# EAGLE design H00R30 (EAGLE 9.3.0)
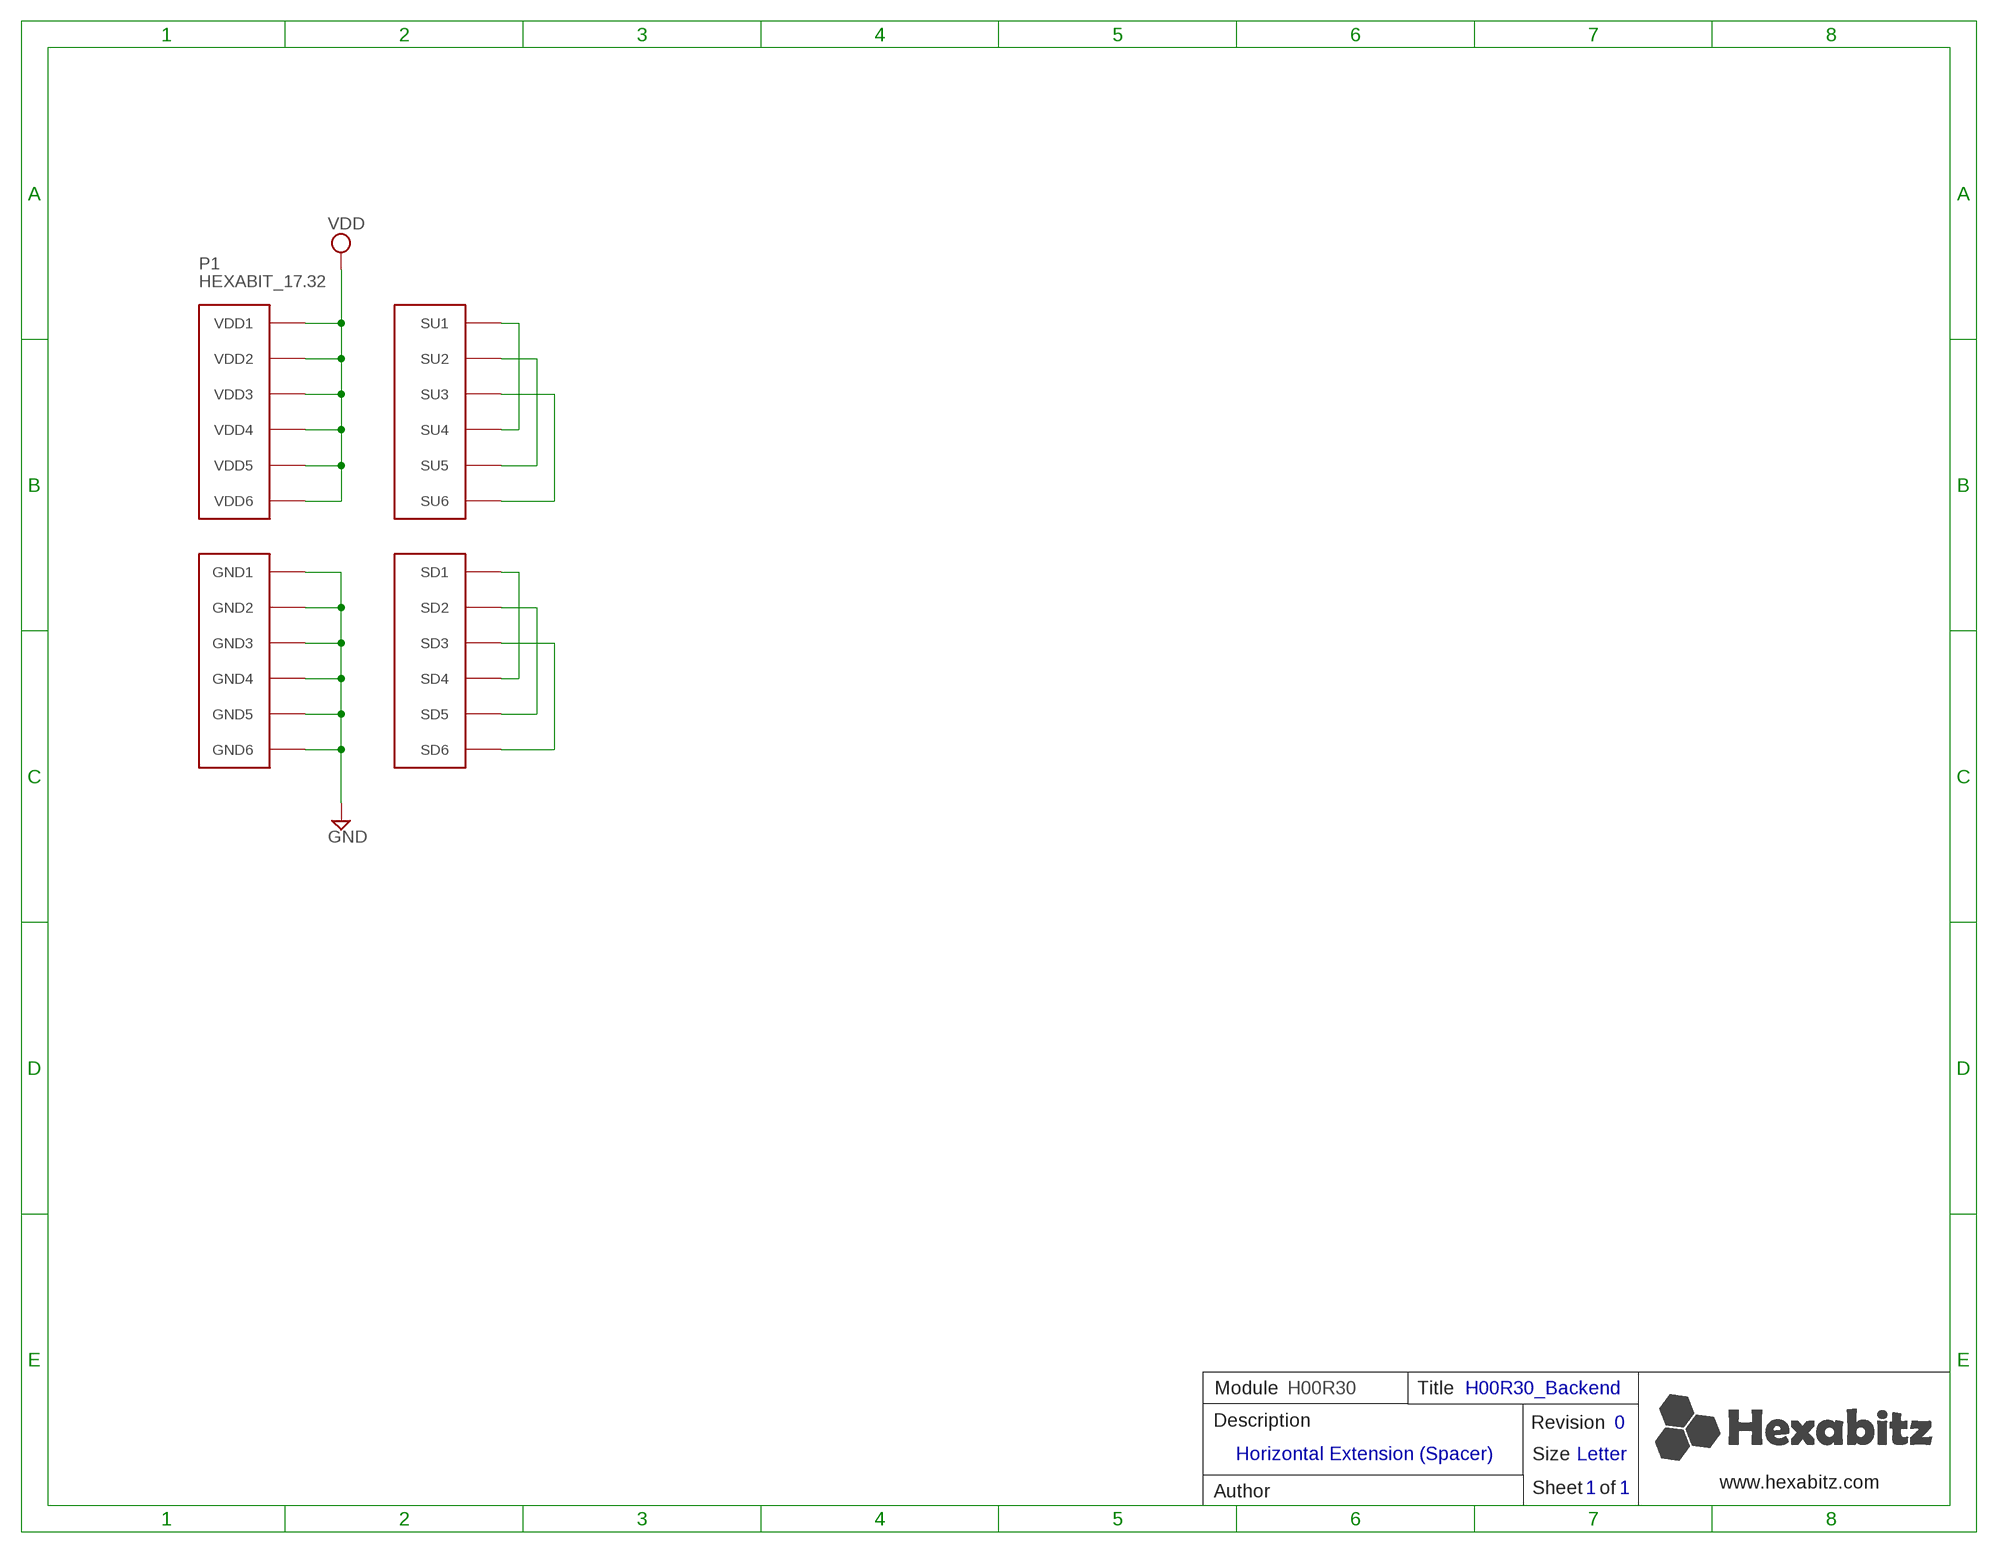
[diagram p0: schematic, sheet 1]

## Parts
P1  HEXABIT_17.32  [HEXABIT_17.32]

## Nets
GND: P1.PAD_PD7(GND1) P1.PAD_PD8(GND2) P1.PAD_PD9(GND3) P1.PAD_PD10(GND4) P1.PAD_PD11(GND5) P1.PAD_PD12(GND6)
N$1: P1.PAD_PU1(SU1) P1.PAD_PU4(SU4)
N$2: P1.PAD_PU2(SU2) P1.PAD_PU5(SU5)
N$3: P1.PAD_PU3(SU3) P1.PAD_PU6(SU6)
N$7: P1.PAD_PD1(SD1) P1.PAD_PD4(SD4)
N$8: P1.PAD_PD2(SD2) P1.PAD_PD5(SD5)
N$9: P1.PAD_PD3(SD3) P1.PAD_PD6(SD6)
VDD: P1.PAD_PU7(VDD1) P1.PAD_PU8(VDD2) P1.PAD_PU9(VDD3) P1.PAD_PU10(VDD4) P1.PAD_PU11(VDD5) P1.PAD_PU12(VDD6)

## Notes on the sheet
- Module | H00R30 | Title | H00R30_Backend
- Description | Revision | 0
- Horizontal Extension (Spacer)
- Size | Letter
- www.hexabitz.com
- Author | Sheet   of | 1 | 1
- C:/Users/Admin/Desktop/logodraft.bmp

## Library data of the parts
P1 = hexabitz_connectors:HEXABIT_?: Hexabitz Hexagon Module Connector Hexagon side length = 17.32mm.

## Board
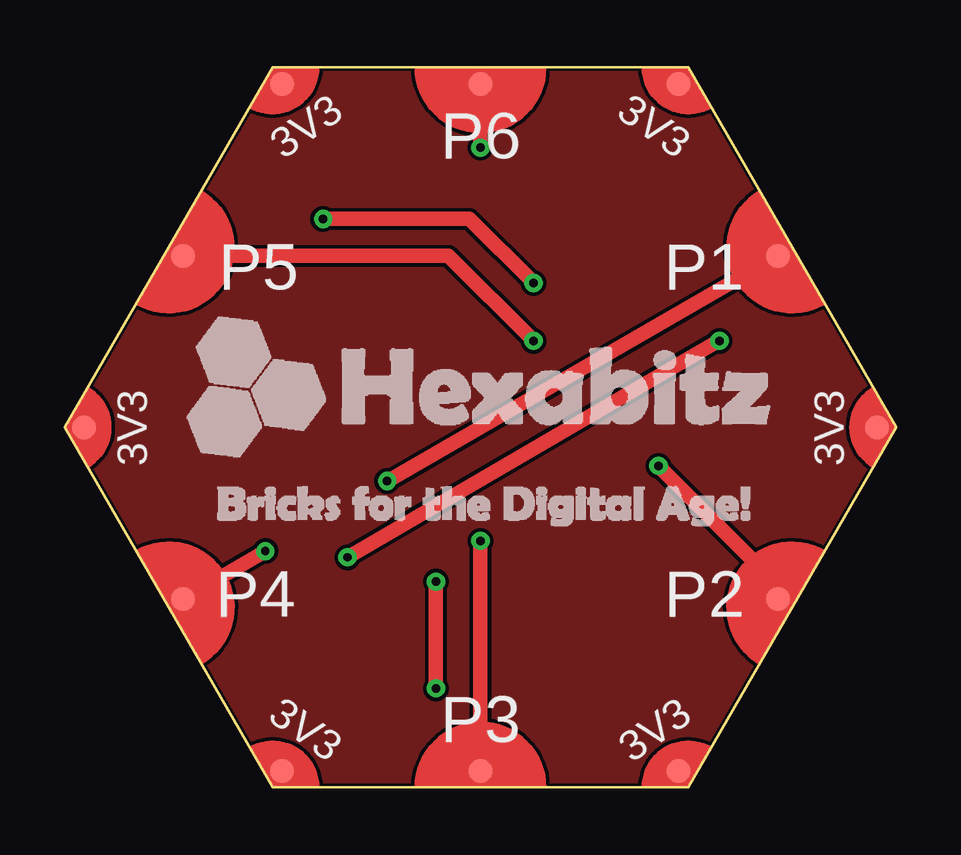
[diagram p1: board, top side]
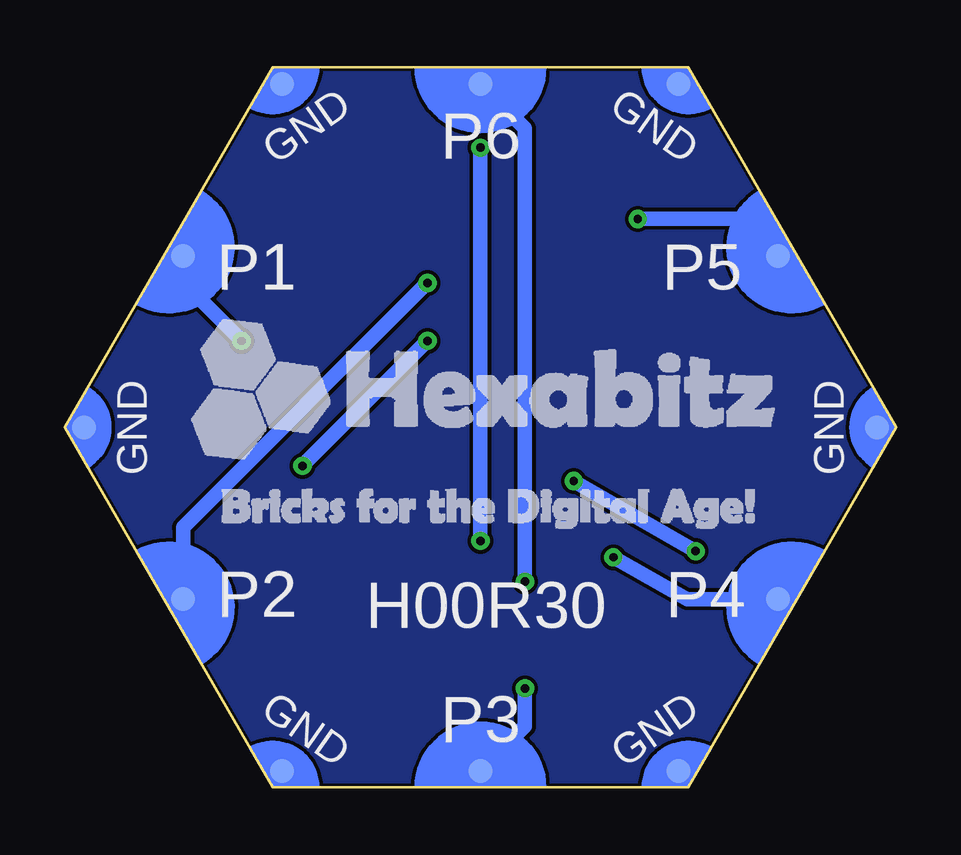
[diagram p2: board, bottom side, seen from below]

Size 34.64 x 30 mm. Coordinates in mm from the lower left corner, seen from the top.
Copper layers (1*16): Top 0.035mm / dielectric 1.5mm / Bottom 0.035mm
Design rules "2_layer": minimum track width 7mil, minimum drill 10mil, track to track 6mil, track to pad 6mil, pad to pad 6mil, via to via 6mil, smd to smd 0mil, copper to edge 1mil, drill to drill 8mil, minimum pad ring 10mil, minimum via ring 8mil, stop-mask expansion 2mil, vias tented up to drill 15mil, thermal gap 10mil

### Footprints (pad centres in the part's own frame; a part is rotated, then mirrored left to right if it is on the bottom)
HEXABIT_17.32 = smd 1 x 1 bottom: PAD_PD1 12.39,7.15; PAD_PD2 12.39,-7.15; PAD_PD3 0,-14.31; PAD_PD4 -12.39,-7.15; PAD_PD5 -12.39,7.15; PAD_PD6 0,14.31; PAD_PD7 8.26,14.31; PAD_PD8 16.52,0; PAD_PD9 8.26,-14.31; PAD_PD10 -8.26,-14.31; PAD_PD11 -16.52,0; PAD_PD12 -8.26,14.31 | smd 1 x 1: PAD_PU1 12.39,7.15; PAD_PU2 12.39,-7.15; PAD_PU3 0,-14.31; PAD_PU4 -12.39,-7.15; PAD_PU5 -12.39,7.15; PAD_PU6 0,14.31; PAD_PU7 8.26,14.31; PAD_PU8 16.52,0; PAD_PU9 8.26,-14.31; PAD_PU10 -8.26,-14.31; PAD_PU11 -16.52,0; PAD_PU12 -8.26,14.31

### Placement (x,y rotation side)
P1  17.32,15 0 top

### Tracks (layer width: path | path; a pad name or v marks a point on that pad's centre or on a via)
GND
  pour Bottom (isolate 0.102, no thermals): 8.66,0 25.98,0 34.64,15 25.98,30 8.66,30 0,15
N$1  (via drill 0.35)
  Top 0.61: v13.43,12.76 P1.PAD_PU1 | v8.35,9.84 P1.PAD_PU4
  Bottom 0.61: v8.35,9.84 v13.43,12.76
N$2  (via drill 0.35)
  Top 0.61: P1.PAD_PU5 5.94,22.15 15.99,22.15 v19.53,18.61 | v24.74,13.4 29.71,8.43
  Top 0.813: 29.71,8.43 P1.PAD_PU2
  Bottom 0.61: v19.53,18.61 v24.74,13.4
N$3  (via drill 0.35)
  Top 0.61: P1.PAD_PU6 v17.32,26.66 | v17.32,10.28 P1.PAD_PU3
  Bottom 0.61: v17.32,26.66 v17.32,10.28
N$7  (via drill 0.35)
  Top 0.61: v27.28,18.61 27.24,18.61 v11.78,9.59
  Bottom 0.61: P1.PAD_PD4 8.71,7.85 v11.78,9.59 | v27.28,18.61 29.71,21.04 P1.PAD_PD1
N$8  (via drill 0.35)
  Top 0.61: v10.77,23.69 16.86,23.69 v19.53,21.02
  Bottom 0.61: P1.PAD_PD5 6.47,23.69 v10.77,23.69 | v19.53,21.02 29.71,10.84 P1.PAD_PD2
N$9  (via drill 0.35)
  Top 0.61: v15.47,8.57 v15.47,4.13
  Bottom 0.61: P1.PAD_PD6 15.47,27.46 v15.47,8.57 | P1.PAD_PD3 15.47,2.54 v15.47,4.13
VDD
  pour Top (isolate 0.102, no thermals): 8.66,0 25.98,0 34.64,15 25.98,30 8.66,30 0,15

### Text on the board
tPlace: 3V3 | P6 | 3V3 | P5 | P1 | 3V3 | 3V3 | P4 | P2 | 3V3 | P3 | 3V3
bPlace: GND | P6 | GND | P5 | P1 | GND | GND | P4 | P2 | H00R30 | GND | P3 | GND